# Altium schematic sheet H-Bridge.SchDoc
size A; SheetNumber: 1; SheetTotal: 1
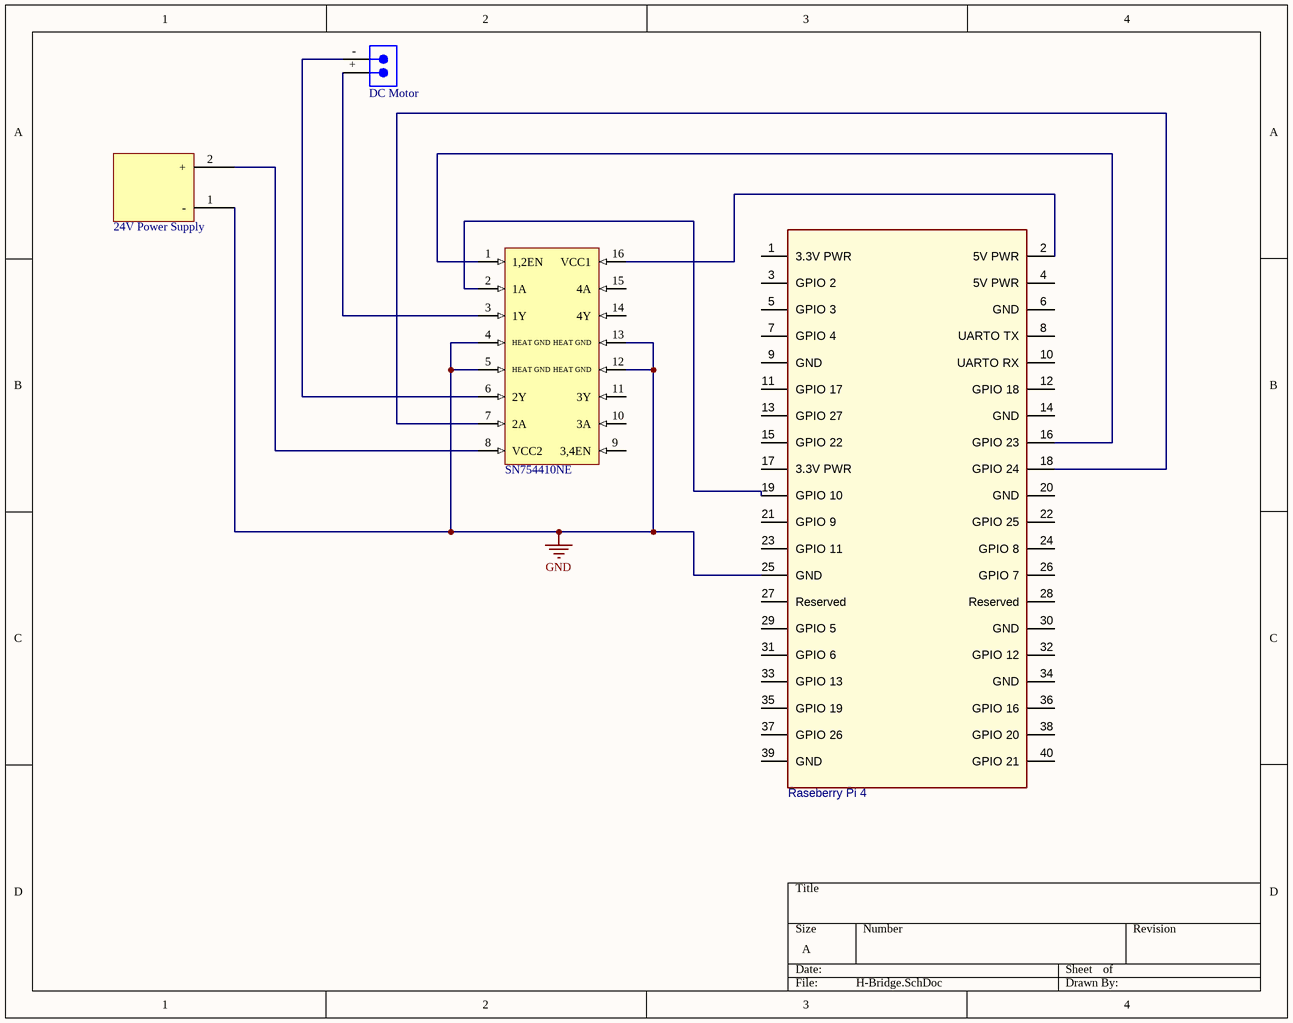
[diagram p0: H-Bridge.SchDoc]

## Parts
?  SN754410NE  [SN754410NE - Design]  (part A of 2)
CN?  Raseberry Pi 4  [TECO-1746540-4_V]
DC_Motor  620302124022  [620302124022]  (value not drawn)
U?  24V Power Supply  [AMTC-AME15-MAZ]

## Nets
GND: ?.4(HEAT_GND) ?.5(HEAT_GND) ?.12(HEAT_GND) ?.13(HEAT_GND) CN?.25(GND) U?.1(-)
Net?_1: ?.1(1,2EN) CN?.16(GPIO_23)
Net?_2: ?.2(1A) CN?.19(GPIO_10)
Net?_3: ?.3(1Y) DC_Motor.+
Net?_6: ?.6(2Y) DC_Motor.-
Net?_7: ?.7(2A) CN?.18(GPIO_24)
Net?_8: ?.8(VCC2) U?.2(+)
Net?_16: ?.16(VCC1) CN?.2(5V_PWR)

Not connected (* = marked no-connect by the designer): ? 9(3,4EN) 10(3A) 11(3Y) 14(4Y) 15(4A); CN? 1(3.3V_PWR) 3(GPIO_2) 4(5V_PWR) 5(GPIO_3) 6(GND) 7(GPIO_4) 8(UARTO_TX) 9(GND) 10(UARTO_RX) 11(GPIO_17) 12(GPIO_18) 13(GPIO_27) 14(GND) 15(GPIO_22) 17(3.3V_PWR) 20(GND) 21(GPIO_9) 22(GPIO_25) 23(GPIO_11) 24(GPIO_8) 26(GPIO_7) 27(Reserved) 28(Reserved) 29(GPIO_5) 30(GND) 31(GPIO_6) 32(GPIO_12) 33(GPIO_13) 34(GND) 35(GPIO_19) 36(GPIO_16) 37(GPIO_26) 38(GPIO_20) 39(GND) 40(GPIO_21)

## Library data of the parts
? = TI-SN754410-NE16
CN? = CMP-02187-7: Connector
DC_Motor = CMP-1502-00660-2: NexarPartId: 18818242; Insulation: Insulated; Connector Type: Male Pin; Pitch: 2mm; Insulation Resistance: 1GΩ; Gender: Male; Voltage Rating: 125V; Number of Positions: 2; Contact Resistance: 20mΩ; Operating Supply Voltage: 100V; Current Rating: 2A; Contact Material: Copper; Number of Rows: 1; Flammability Rating: UL94 V-0; Housing Material: Nylon; Lead Pitch: 2mm; Orientation: Vertical; Max Operating Temperature: 85°C; Termination: SMD/SMT; REACH SVHC: Unknown; Contact Mating Length: 3.5052mm; RoHS: Compliant; Packaging: Tape and Reel; Number of Contacts: 2; Height: 6.6mm; Mount: Surface Mount; Number of Pins: 2; Contact Gender: Male; Min Operating Temperature: -40°C; Length: 5mm; Width: 7.9mm; Contact Plating: Tin; Color: Beige, White
U? = CMP-2000-07538-1: AC-DC / DC-DC Converter, 15 W, 24 V, 0.63 A, -40 to 85 degC, 6-Pin THD, RoHS; Manufacturer: Aimtec; Max Output Power: 15W; Case\/Package: DIP; Max Current Rating: 350mA; Number of Outputs: 1; Max Output Current: 630mA; Efficiency: 84%; Package Description: 6-Pin Through Hole Device, Body 65 x 46.5 mm, Pitch 10 mm; Datasheet Version: 07/2016; Max Operating Temperature: 85degC; Mounting Technology: ThroughHole; Manufacturer URL: http://www.aimtec.com/; Package Reference: AME15-MAZ; RoHSCompliant: true; Datasheet URL: https://www.google.com.hk/url?sa=t&rct=j&q=&esrc=s&source=web&cd=1&ved=0ahUKEwj5n73ZsMfWAhXFXbwKHXo5CuUQFggkMAA&url=http%3A%2F%2Fwww.aimtec.com%2Fsite%2FAimtec%2Ffiles%2FDatasheet%2FHighResolution%2FAME15-MAZ.pdf&usg=AFQjCNESjzRlryhEWeRV9RbYXVM_OPFdnw; Min Operating Temperature: -40degC; Output Voltage: 24V